# Altium schematic sheet pump_driver_circuit.SchDoc
size A4
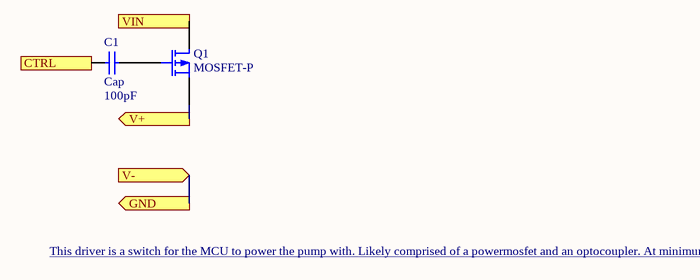
[diagram p0: pump_driver_circuit.SchDoc]

## Parts
C1  Cap  value 100pF  [RAD-0.3]
Q1  MOSFET-P  [E3]

## Ports
CTRL, GND (out), V+ (out), V- (in), VIN (in)

## Nets
CTRL: C1.1 ; port CTRL
GND: port GND, port V-
V+: Q1.3(S) ; port V+
VIN: Q1.1(D) ; port VIN
NetC1_2: C1.2 Q1.2(G)

## Notes on the sheet
- This driver is a switch for the MCU to power the pump with. Likely comprised of a powermosfet and an optocoupler. At minimum could be an AC coupled MOSFET. <https://www.rpelectronics.com/tip41c-npn-transistor-to220-100v-6a.html>

## Library data of the parts
C1 = Cap: Capacitor; Published: 8-Jun-2000; LatestRevisionDate: 17-Jul-2002; LatestRevisionNote: Re-released for DXP Platform.; PackageReference: RAD-0.3; Publisher: Altium Limited; PackageDescription: Radial Cap, Thru-Hole; 2 Leads; 0.3 in Pin Spacing
Q1 = MOSFET-P: P-Channel MOSFET; Published: 8-Jun-2000; LatestRevisionDate: 17-Jul-2002; LatestRevisionNote: Re-released for DXP Platform.; PackageVersion: 1995/1996; PackageReference: E3; Publisher: Altium Limited; PackageDescription: TO, Flat Index; 3 In-Line, Axial Leads; Body Dia. 4.6mm; Lead Dia. 0.5 mm (max); ComponentLink1Description: RP source; ComponentLink1URL: https://www.rpelectronics.com/tip41c-npn-transistor-to220-100v-6a.html